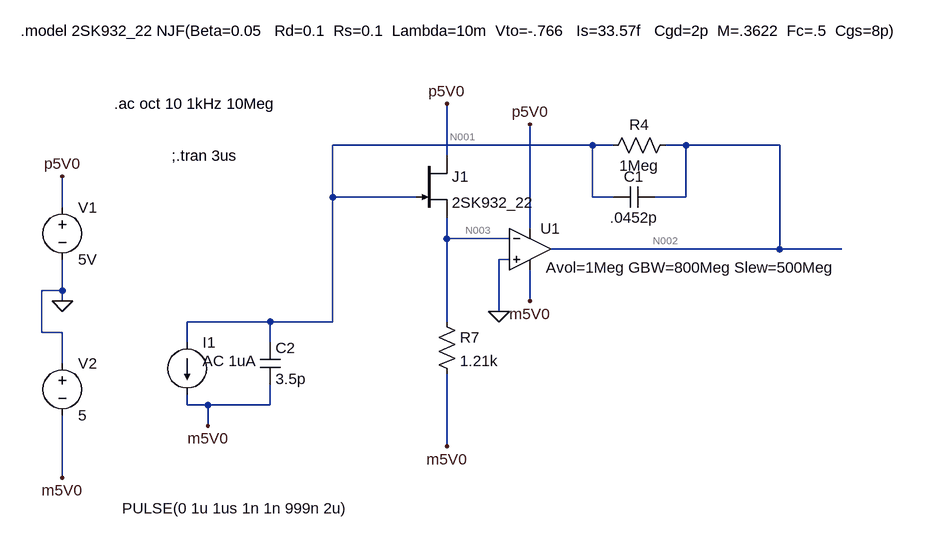
[diagram p0: schematic LT6228 with JFET in TIA.asc]
LT6228 with JFET in TIA.asc, the LTspice schematic file:
Version 4
SHEET 1 3232 872
WIRE 720 -144 320 -144
WIRE 752 -144 720 -144
WIRE 864 -144 832 -144
WIRE 1008 -144 864 -144
WIRE 496 -128 496 -208
WIRE 320 -64 320 -144
WIRE 448 -64 320 -64
WIRE 720 -64 720 -144
WIRE 752 -64 720 -64
WIRE 864 -64 864 -144
WIRE 864 -64 816 -64
WIRE -96 -48 -96 -96
WIRE 624 -16 624 -176
WIRE 496 0 496 -32
WIRE 592 0 496 0
WIRE 1008 16 1008 -144
WIRE 1008 16 656 16
WIRE 1104 16 1008 16
WIRE 592 32 576 32
WIRE -96 80 -96 32
WIRE -96 80 -128 80
WIRE -96 96 -96 80
WIRE 624 96 624 48
WIRE 576 112 576 32
WIRE 224 128 96 128
WIRE 320 128 320 -64
WIRE 320 128 224 128
WIRE 496 128 496 0
WIRE -128 144 -128 80
WIRE -96 144 -128 144
WIRE 96 160 96 128
WIRE 224 160 224 128
WIRE -96 192 -96 144
WIRE 96 256 96 240
WIRE 128 256 96 256
WIRE 224 256 224 224
WIRE 224 256 128 256
WIRE 128 288 128 256
WIRE 496 320 496 208
WIRE -96 368 -96 272
FLAG -96 96 0
FLAG 576 112 0
FLAG -96 -96 p5V0
FLAG -96 368 m5V0
FLAG 496 -208 p5V0
FLAG 624 -176 p5V0
FLAG 496 320 m5V0
FLAG 624 96 m5V0
FLAG 128 288 m5V0
SYMBOL njf 448 -128 R0
SYMATTR InstName J1
SYMATTR Value 2SK932_22
SYMBOL voltage -96 -64 R0
SYMATTR InstName V1
SYMATTR Value 5V
SYMBOL current 96 160 R0
WINDOW 3 -100 255 Left 2
WINDOW 123 24 28 Left 2
WINDOW 39 0 0 Left 2
SYMATTR Value PULSE(0 1u 1us 1n 1n 999n 2u)
SYMATTR Value2 AC 1uA
SYMATTR InstName I1
SYMBOL voltage -96 176 R0
SYMATTR InstName V2
SYMATTR Value 5
SYMBOL res 480 112 R0
SYMATTR InstName R7
SYMATTR Value 1.21k
SYMBOL cap 208 160 R0
SYMATTR InstName C2
SYMATTR Value 3.5p
SYMBOL res 848 -160 R90
WINDOW 0 0 56 VBottom 2
WINDOW 3 32 56 VTop 2
SYMATTR InstName R4
SYMATTR Value 1Meg
SYMBOL cap 816 -80 R90
WINDOW 0 0 32 VBottom 2
WINDOW 3 32 32 VTop 2
SYMATTR InstName C1
SYMATTR Value .0452p
SYMBOL Opamps\\UniversalOpamp2 624 16 R0
WINDOW 123 24 28 Left 2
SYMATTR Value2 Avol=1Meg GBW=800Meg Slew=500Meg
SYMATTR InstName U1
SYMATTR SpiceLine2 en=1n enk=1k in=3p ink=1k Rin=500Meg
TEXT -16 -208 Left 2 !.ac oct 10 1kHz 10Meg
TEXT -160 -320 Left 2 !.model 2SK932_22 NJF(Beta=0.05   Rd=0.1  Rs=0.1  Lambda=10m  Vto=-.766   Is=33.57f   Cgd=2p  M=.3622  Fc=.5  Cgs=8p)
TEXT 72 -128 Left 2 !;.tran 3us

The netlist it stands for:
* LT6228 with JFET in TIA.asc
J1 p5V0 N001 N003 2SK932_22
V1 p5V0 0 5V
I1 N001 m5V0 PULSE(0 1u 1us 1n 1n 999n 2u) AC 1uA
V2 0 m5V0 5
R7 N003 m5V0 1.21k
C2 N001 m5V0 3.5p
R4 N002 N001 1Meg
C1 N002 N001 .0452p
XU1 0 N003 p5V0 m5V0 N002 level.2 Avol=1Meg GBW=800Meg Slew=500Meg ilimit=25m rail=0 Vos=0 phimargin=45 en=1n enk=1k in=3p ink=1k Rin=500Meg  ; pins IN+ IN- V+ V- OUT
.model NJF NJF
.model PJF PJF
.lib standard.jft
.ac oct 10 1kHz 10Meg
.model 2SK932_22 NJF(Beta=0.05   Rd=0.1  Rs=0.1  Lambda=10m  Vto=-.766   Is=33.57f   Cgd=2p  M=.3622  Fc=.5  Cgs=8p)
;.tran 3us
.lib UniversalOpamps2.sub
.backanno
.end

* Results of the author's LTspice run, read from the files saved beside the schematic
* Operating Point, zero values left out:
*   V(p5v0) = 5 V
*   V(n001) = -485 mV
*   V(n003) = 487.3 nV
*   V(m5v0) = -5 V
*   V(n002) = -485 mV
*   Id(J1) = 4.132 mA
*   Ig(J1) = -6.037 pA
*   Is(J1) = -4.132 mA
*   I(R4) = -6.037 pA
*   I(R7) = 4.132 mA
*   I(V2) = -4.63 mA
*   I(V1) = -4.63 mA
*   Ix(u1:3) = 497.6 µA
*   Ix(u1:4) = -497.6 µA
*   Ix(u1:5) = 6.037 pA